# Altium project Bran.PrjPCB
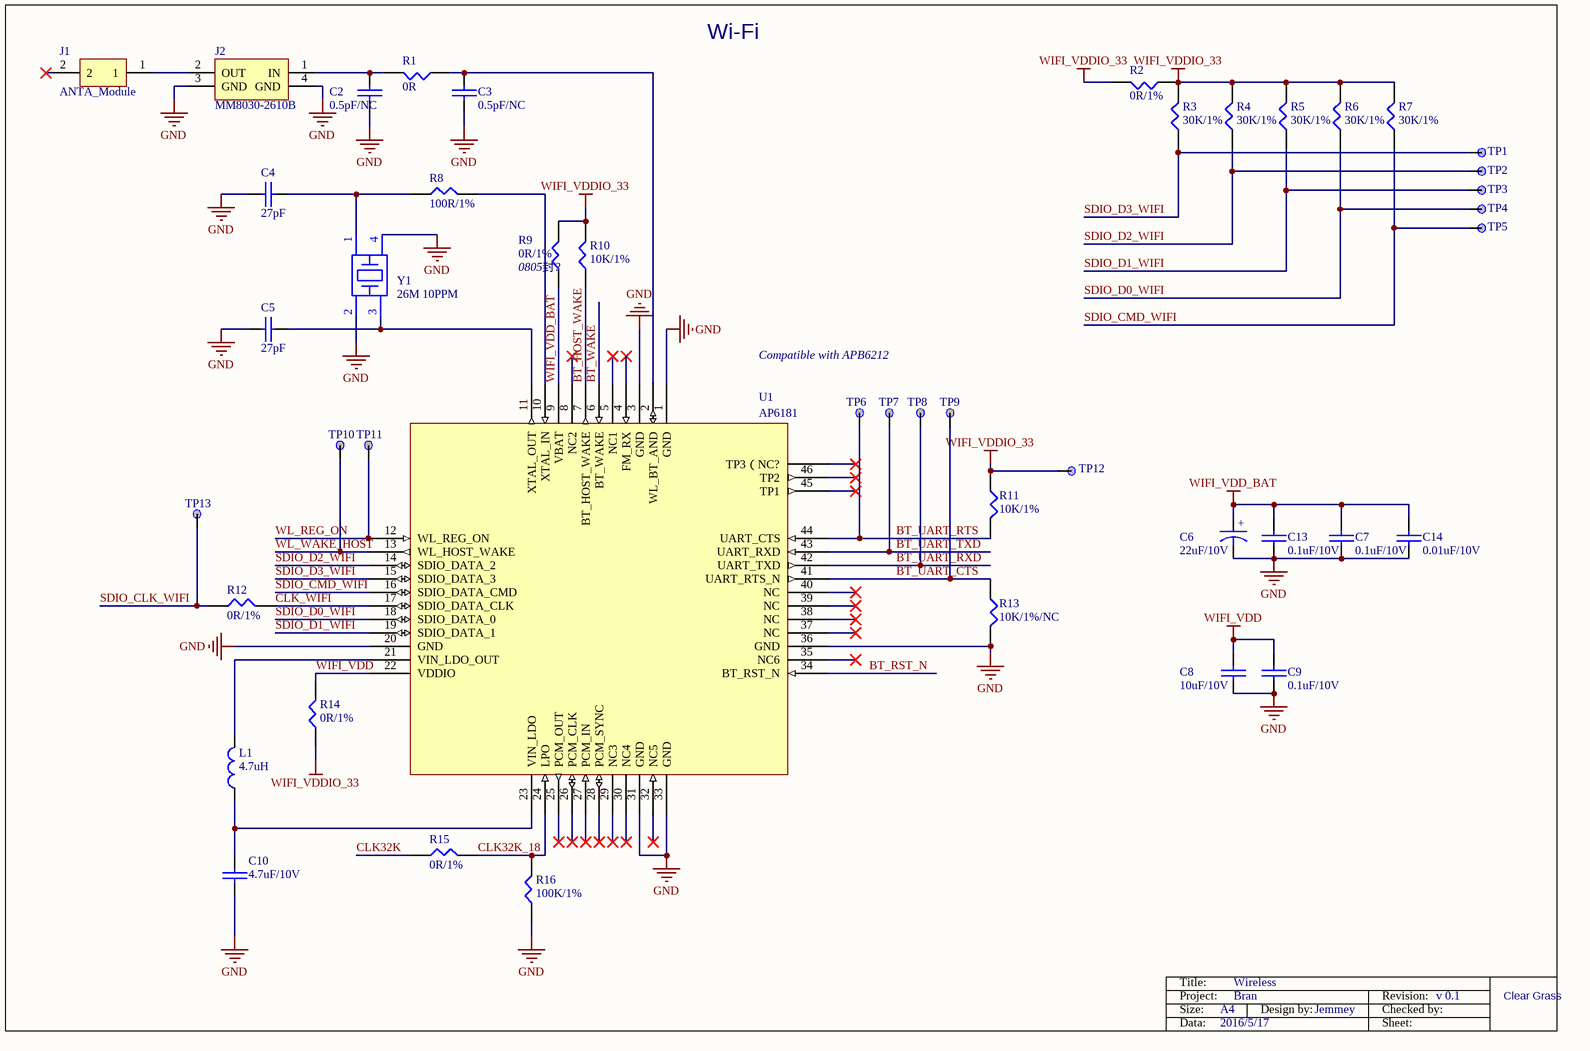
[diagram p0: Wireless.SchDoc]
6 sheets, 197 parts. Net scope: flat (ports and power ports of the same name join across sheets).
Sheets:
  Wireless.SchDoc
  NandFlash.SchDoc
  PMU.SchDoc
  Power.SchDoc
  Peripherals.SchDoc
  Auxiliary.SchDoc

## Sheet Wireless.SchDoc: main_assy PCB
size A4

### Parts
(Parts that share a designator on the sheet are numbered #1, #2 ... from top to bottom, then left to right.)
C2  0.5pF/NC  [0402C]
C3  0.5pF/NC  [0402C]
C4  27pF  [0402C]
C5  27pF  [0402C]
C6  22uF/10V  [6032]
C7  0.1uF/10V  [0402C]
C8  10uF/10V  [0402C]
C9  0.1uF/10V  [0402C]
C10  4.7uF/10V  [0402C]
C13  0.1uF/10V  [0402C]
C14  0.01uF/10V  [0402C]
J1  ANTA_Module  [IPEX]
J2  MM8030-2610B  [IPEX]
L1  4.7uH  [Inductance]
R1  0R  [0402R]
R2  0R/1%  [0402R]
R3  30K/1%  [0402R]
R4  30K/1%  [0402R]
R5  30K/1%  [0402R]
R6  30K/1%  [0402R]
R7  30K/1%  [0402R]
R8  100R/1%  [0402R]
R9  0R/1%  [0402R]
R10#1  10K/1%  [0402R]
R11  10K/1%  [0402R]
R12  0R/1%  [0402R]
R13  10K/1%/NC  [0402R]
R14  0R/1%  [0402R]
R15  0R/1%  [0402R]
R16  100K/1%  [0402R]
TP1  TP  [TP_C40]  (value not drawn)
TP2  TP  [TP_C40]  (value not drawn)
TP3  TP  [TP_C40]  (value not drawn)
TP4  TP  [TP_C40]  (value not drawn)
TP5  TP  [TP_C40]  (value not drawn)
TP6  TP  [TP_C40]  (value not drawn)
TP7  TP  [TP_C40]  (value not drawn)
TP8  TP  [TP_C40]  (value not drawn)
TP9  TP  [TP_C40]  (value not drawn)
TP10  TP  [TP_C40]  (value not drawn)
TP11  TP  [TP_C40]  (value not drawn)
TP12  TP  [TP_C40]  (value not drawn)
TP13  TP  [TP_C40]  (value not drawn)
U1  AP6181
Y1  26M 10PPM  [XTALSMD2-2520]

### Nets
GND: C2.2 C3.2 C4.1 C5.1 C6.2 C7.1 C8.1 C9.1 C10.2 C13.1 C14.1 J2.3(GND) J2.4(GND) R13.2 R16.1 U1.1(GND) U1.3(GND) U1.20(GND) U1.31(GND) U1.33(GND) U1.36(GND) Y1.2 Y1.4
WIFI_VDD: C8.2 C9.2 R14.2 U1.22(VDDIO)
WIFI_VDD_BAT: C6.1 C7.2 C13.2 C14.2 R9.1 U1.9(VBAT)
WIFI_VDDIO_33: R2.1 R2.2 R3.2 R4.2 R5.2 R6.2 R7.2 R9.2 R10#1.2 R11.1 R14.1 TP12.1
BT_HOST_WAKE: R10#1.1 U1.7(BT_HOST_WAKE)
BT_RST_N: U1.34(BT_RST_N)
BT_UART_CTS: R13.1 TP9.1 U1.41(UART_RTS_N)
BT_UART_RTS: R11.2 TP6.1 U1.44(UART_CTS)
BT_UART_RXD: TP8.1 U1.42(UART_TXD)
BT_UART_TXD: TP7.1 U1.43(UART_RXD)
BT_WAKE: U1.6(BT_WAKE)
CLK32K: R15.1
CLK32K_18: R15.2 R16.2 U1.24(LPO)
CLK_WIFI: R12.2 U1.17(SDIO_DATA_CLK)
SDIO_CLK_WIFI: R12.1 TP13.1
SDIO_CMD_WIFI: R7.1 TP5.1 U1.16(SDIO_DATA_CMD)
SDIO_D0_WIFI: R6.1 TP4.1 U1.18(SDIO_DATA_0)
SDIO_D1_WIFI: R5.1 TP3.1 U1.19(SDIO_DATA_1)
SDIO_D2_WIFI: R4.1 TP2.1 U1.14(SDIO_DATA_2)
SDIO_D3_WIFI: R3.1 TP1.1 U1.15(SDIO_DATA_3)
WL_REG_ON: TP11.1 U1.12(WL_REG_ON)
WL_WAKE_HOST: TP10.1 U1.13(WL_HOST_WAKE)
NetC2_1: C2.1 J2.1(IN) R1.2
NetC3_1: C3.1 R1.1 U1.2(WL_BT_AND)
NetC4_2: C4.2 R8.1 Y1.1
NetC5_2: C5.2 U1.11(XTAL_OUT) Y1.3
NetC10_1: C10.1 L1.1 U1.23(VIN_LDO)
NetJ1_1: J1.1 J2.2(OUT)
NetL1_2: L1.2 U1.21(VIN_LDO_OUT)
NetR8_2: R8.2 U1.10(XTAL_IN)

Not connected (* = marked no-connect by the designer): J1 2*; U1 4(FM_RX)* 5(NC1)* 8(NC2)* 25(PCM_OUT)* 26(PCM_CLK)* 27(PCM_IN)* 28(PCM_SYNC)* 29(NC3)* 30(NC4)* 32(NC5)* 35(NC6)* 37(NC)* 38(NC)* 39(NC)* 40(NC)* 45(TP1)* 46(TP2)* ?1(TP3（NC?)*

### Notes on the sheet
- Wi-Fi
- (near R9) 0805封?
- Compatible with APB6212
- Title:
- Wireless
- Project:
- Size:
- Data:
- A4
- 2016/5/17
- Bran
- Design by:
- Jemmey
- Revision:
- Sheet:
- Checked by:
- v 0.1
- Clear Grass
- (in symbol Capacitor) +

### Library data of the parts
C2 = CAP: 厂家：Murata，型号：GRM1555C1H1R0BA01D
C3 = CAP: None
C4 C5 C7-C10 C13 C14 = CAP: 厂家：Murata，型号：GRM155R71A104KA01D
C6 = Capacitor
J2 = SMA: 厂家：Murata，型号：MM8030-2610B
L1 = CHOKE
R1 = RES1: 厂家：Yageo，型号：RC0402FR-070RL
R2-R9 R10#1 R11-R16 = RES1: 厂家：Yageo，型号：RC0402FR-0710KL
TP1-TP13 = TP: Ordered by: Subcon
U1 = AP6181: 厂家：正基，型号：AP6181
Y1 = CRYSTAL2: 厂家：EPSON，型号：Q24FA20H0004400

## Sheet NandFlash.SchDoc: main_assy PCB
size A4
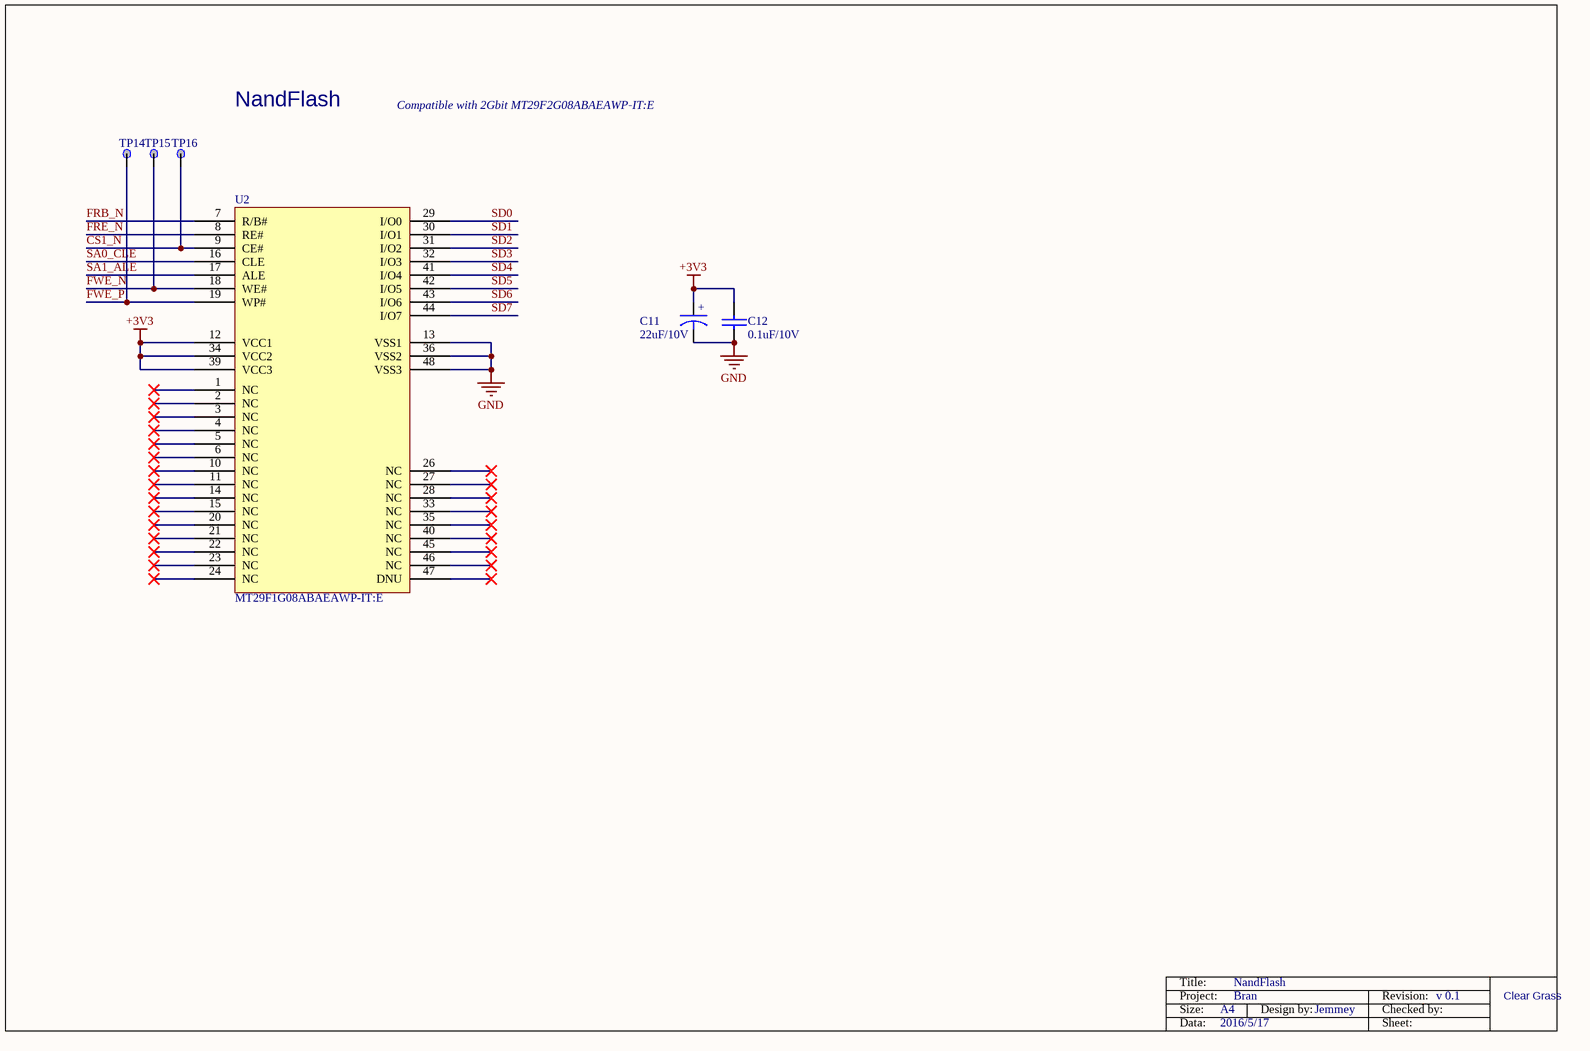
[diagram p1: NandFlash.SchDoc]

### Parts
C11  22uF/10V  [6032]
C12  0.1uF/10V  [0402C]
TP14  TP  [TP_C40]  (value not drawn)
TP15  TP  [TP_C40]  (value not drawn)
TP16  TP  [TP_C40]  (value not drawn)
U2  MT29F1G08ABAEAWP-IT:E

### Nets
+3V3: C11.1 C12.2 U2.12(VCC1) U2.34(VCC2) U2.39(VCC3)
GND: C11.2 C12.1 U2.13(VSS1) U2.36(VSS2) U2.48(VSS3)
CS1_N: TP16.1 U2.9(CE#)
FRB_N: U2.7(R/B#)
FRE_N: U2.8(RE#)
FWE_N: TP15.1 U2.18(WE#)
FWE_P: TP14.1 U2.19(WP#)
SA0_CLE: U2.16(CLE)
SA1_ALE: U2.17(ALE)
SD0: U2.29(I/O0)
SD1: U2.30(I/O1)
SD2: U2.31(I/O2)
SD3: U2.32(I/O3)
SD4: U2.41(I/O4)
SD5: U2.42(I/O5)
SD6: U2.43(I/O6)
SD7: U2.44(I/O7)

Not connected (* = marked no-connect by the designer): U2 1(NC)* 2(NC)* 3(NC)* 4(NC)* 5(NC)* 6(NC)* 10(NC)* 11(NC)* 14(NC)* 15(NC)* 20(NC)* 21(NC)* 22(NC)* 23(NC)* 24(NC)* 26(NC)* 27(NC)* 28(NC)* 33(NC)* 35(NC)* 40(NC)* 45(NC)* 46(NC)* 47(DNU)*

### Notes on the sheet
- NandFlash
- Compatible with 2Gbit MT29F2G08ABAEAWP-IT:E
- Title:
- Project:
- Size:
- Data:
- A4
- 2016/5/17
- Bran
- Design by:
- Jemmey
- Revision:
- Sheet:
- Checked by:
- v 0.1
- Clear Grass
- (in symbol Capacitor) +

### Library data of the parts
C11 = Capacitor
C12 = CAP: 厂家：Murata，型号：GRM155R71A104KA01D
TP14-TP16 = TP: Ordered by: Subcon
U2 = NandFlash

## Sheet PMU.SchDoc: main_assy PCB
size A4
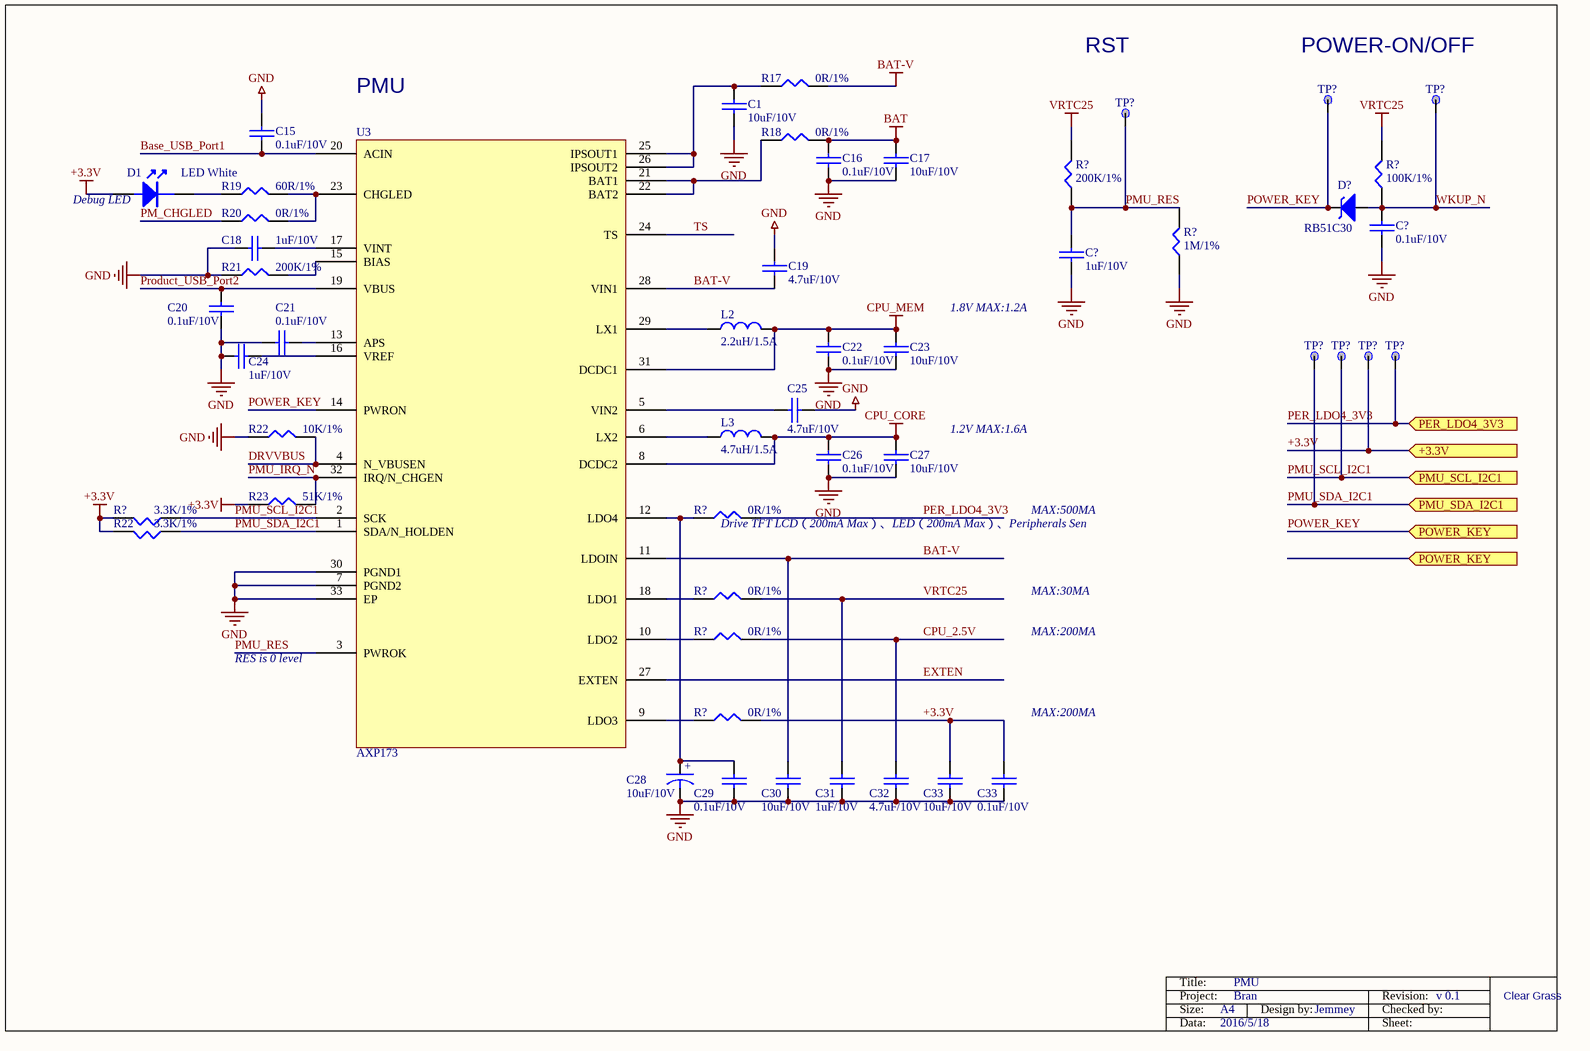
[diagram p2: PMU.SchDoc]

### Parts
(Parts that share a designator on the sheet are numbered #1, #2 ... from top to bottom, then left to right.)
C1  10uF/10V  [0402C]
C15  0.1uF/10V  [0402C]
C16  0.1uF/10V  [0402C]
C17  10uF/10V  [0402C]
C18  1uF/10V  [0402C]
C19  4.7uF/10V  [0402C]
C20  0.1uF/10V  [0402C]
C21  0.1uF/10V  [0402C]
C22  0.1uF/10V  [0402C]
C23  10uF/10V  [0402C]
C24  1uF/10V  [0402C]
C25  4.7uF/10V  [0402C]
C26  0.1uF/10V  [0402C]
C27#1  10uF/10V  [0402C]
C28  10uF/10V  [6032]
C29  0.1uF/10V  [0402C]
C30  10uF/10V  [0402C]
C31  1uF/10V  [0402C]
C32  4.7uF/10V  [0402C]
C33#1  10uF/10V  [0402C]
C33#2  0.1uF/10V  [0402C]
C?#1  0.1uF/10V  [0402C]
C?#2  1uF/10V  [0402C]
D1  LED White  [0402LED]
D?  RB51C30  [DO-214AC]
L2  2.2uH/1.5A  [Inductance]
L3#1  4.7uH/1.5A  [Inductance]
R17  0R/1%  [0402R]
R18  0R/1%  [0402R]
R19  60R/1%  [0402R]
R20  0R/1%  [0402R]
R21  200K/1%  [0402R]
R22#1  10K/1%  [0402R]
R22#2  3.3K/1%  [0402R]
R23  51K/1%  [0402R]
R?#1  200K/1%  [0402R]
R?#2  100K/1%  [0402R]
R?#3  1M/1%  [0402R]
R?#4  0R/1%  [0402R]
R?#5  3.3K/1%  [0402R]
R?#6  0R/1%  [0402R]
R?#7  0R/1%  [0402R]
R?#8  0R/1%  [0402R]
TP?#1  TP  [TP_C40]  (value not drawn)
TP?#2  TP  [TP_C40]  (value not drawn)
TP?#3  TP  [TP_C40]  (value not drawn)
TP?#4  TP  [TP_C40]  (value not drawn)
TP?#5  TP  [TP_C40]  (value not drawn)
TP?#6  TP  [TP_C40]  (value not drawn)
TP?#7  TP  [TP_C40]  (value not drawn)
U3  AXP173

### Ports
+3.3V (in), PER_LDO4_3V3 (in), PMU_SCL_I2C1 (in), PMU_SDA_I2C1 (in), POWER_KEY (in)

### Nets
+3.3V: C33#1.1 C33#2.1 D1.2 R22#2.2 R23.1 R?#5.2 R?#8.2 TP?#6.1 ; port +3.3V
BAT: C16.2 C17.2 R18.2
BAT-V: C19.2 C30.1 R17.2 U3.11(LDOIN) U3.28(VIN1)
CPU_CORE: C26.2 C27#1.2 L3#1.2 U3.8(DCDC2)
CPU_MEM: C22.2 C23.2 L2.2 U3.31(DCDC1)
GND: C1.1 C15.2 C16.1 C17.1 C18.2 C19.1 C20.1 C21.2 C22.1 C23.1 C24.2 C25.1 C26.1 C27#1.1 C28.2 C29.1 C30.2 C31.2 C32.2 C33#1.2 C33#2.2 C?#1.1 C?#2.1 R21.1 R22#1.1 R?#3.1 U3.7(PGND2) U3.30(PGND1) U3.33(EP)
PER_LDO4_3V3: R?#4.2 TP?#7.1 ; port PER_LDO4_3V3
VRTC25: C31.1 R?#1.2 R?#2.2 R?#6.2
Base_USB_Port1: C15.1 U3.20(ACIN)
CPU_2.5V: C32.1 R?#7.2
DRVVBUS: R22#1.2 U3.4(N_VBUSEN)
EXTEN: U3.27(EXTEN)
PM_CHGLED: R20.1
PMU_IRQ_N: R23.2 U3.32(IRQ/N_CHGEN)
PMU_RES: C?#2.2 R?#1.1 R?#3.2 TP?#3.1 U3.3(PWROK)
PMU_SCL_I2C1: R?#5.1 TP?#5.1 U3.2(SCK) ; port PMU_SCL_I2C1
PMU_SDA_I2C1: R22#2.1 TP?#4.1 U3.1(SDA/N_HOLDEN) ; port PMU_SDA_I2C1
POWER_KEY: D?.1(K) TP?#1.1 U3.14(PWRON) ; port POWER_KEY
Product_USB_Port2: C20.2 U3.19(VBUS)
TS: U3.24(TS)
WKUP_N: C?#1.2 D?.2(A) R?#2.1 TP?#2.1
NetC1_2: C1.2 R17.1 U3.25(IPSOUT1) U3.26(IPSOUT2)
NetC18_1: C18.1 U3.17(VINT)
NetC21_1: C21.1 U3.13(APS)
NetC24_1: C24.1 U3.16(VREF)
NetC25_2: C25.2 U3.5(VIN2)
NetC28_1: C28.1 C29.2 R?#4.1 U3.12(LDO4)
NetD1_1: D1.1 R19.1
NetL2_1: L2.1 U3.29(LX1)
NetL3#1_1: L3#1.1 U3.6(LX2)
NetR18_1: R18.1 U3.21(BAT1) U3.22(BAT2)
NetR19_2: R19.2 R20.2 U3.23(CHGLED)
NetR21_2: R21.2 U3.15(BIAS)
NetR?#6_1: R?#6.1 U3.18(LDO1)
NetR?#7_1: R?#7.1 U3.10(LDO2)
NetR?#8_1: R?#8.1 U3.9(LDO3)

### Notes on the sheet
- PMU
- RST
- (near TP?#1) POWER-ON/OFF
- (near D1) Debug LED
- 1.8V MAX:1.2A
- 1.2V MAX:1.6A
- MAX:500MA
- (near R?#4) Drive TFT LCD（200mA Max）、LED（200mA Max）、Peripherals Sen
- MAX:30MA
- MAX:200MA
- (near U3) RES is 0 level
- Title:
- Project:
- Size:
- Data:
- A4
- 2016/5/18
- Bran
- Design by:
- Jemmey
- Revision:
- Sheet:
- Checked by:
- v 0.1
- Clear Grass
- (in symbol Capacitor) +

### Library data of the parts
C1 C15-C26 C27#1 C29-C32 C33#1 C33#2 C?#1 C?#2 = CAP: 厂家：Murata，型号：GRM155R71A104KA01D
C28 = Capacitor
D1 = LED: 厂家：ROHM，型号：SCMP13WBC8W1**
D? = Schottky barri: 厂家：ROHM，型号：RB480Y-90
L2 L3#1 = CHOKE
R17-R21 R22#1 R22#2 R23 R?#1-R?#8 = RES1: 厂家：Yageo，型号：RC0402FR-0710KL
TP?#1-TP?#7 = TP: Ordered by: Subcon

## Sheet Power.SchDoc: main_assy PCB
size A4
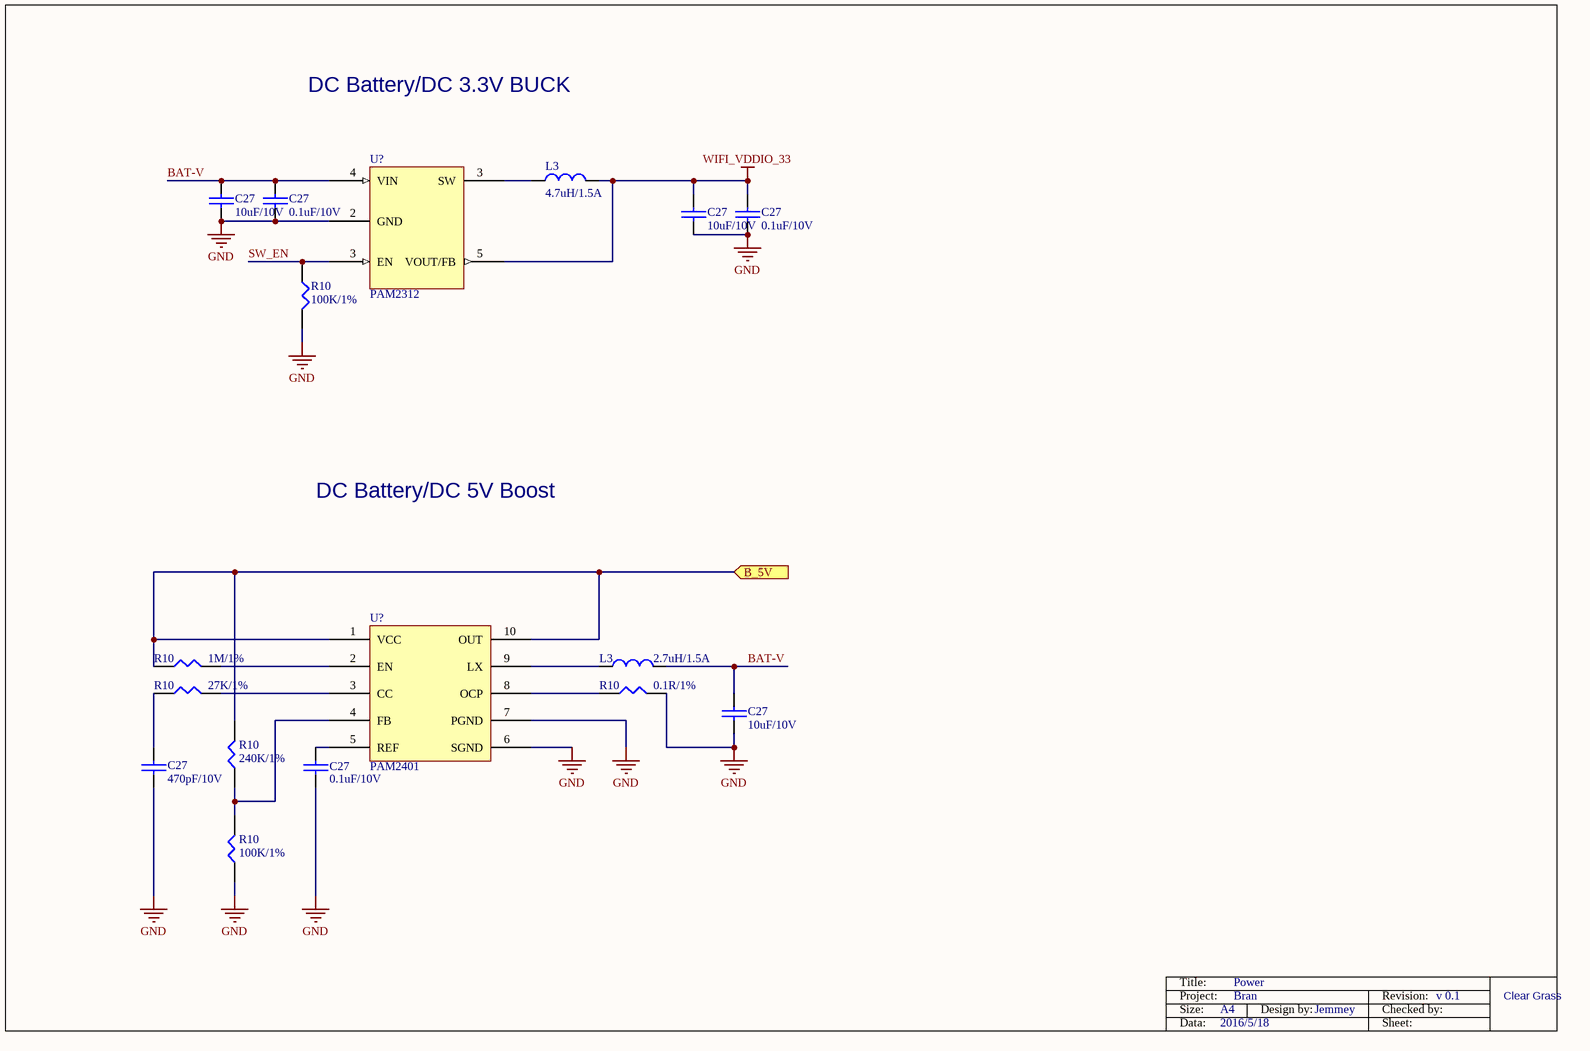
[diagram p3: Power.SchDoc]

### Parts
(Parts that share a designator on the sheet are numbered #1, #2 ... from top to bottom, then left to right.)
C27#2  10uF/10V  [0402C]
C27#3  0.1uF/10V  [0402C]
C27#4  10uF/10V  [0402C]
C27#5  0.1uF/10V  [0402C]
C27#6  10uF/10V  [0402C]
C27#7  470pF/10V  [0402C]
C27#8  0.1uF/10V  [0402C]
L3#2  4.7uH/1.5A  [Inductance]
L3#3  2.7uH/1.5A  [Inductance]
R10#2  100K/1%  [0402R]
R10#3  1M/1%  [0402R]
R10#4  27K/1%  [0402R]
R10#5  0.1R/1%  [0402R]
R10#6  240K/1%  [0402R]
R10#7  100K/1%  [0402R]
U?#1  PAM2312  [MOLEX_47590001]
U?#2  PAM2401  [MOLEX_47590001]

### Ports
B_5V (in)

### Nets
GND: C27#2.1 C27#3.1 C27#4.1 C27#5.1 C27#6.1 C27#7.1 C27#8.1 R10#2.2 R10#5.2 R10#7.1 U?#1.2(GND) U?#2.6(SGND) U?#2.7(PGND)
WIFI_VDDIO_33: C27#4.2 C27#5.2 L3#2.2 U?#1.5(VOUT/FB)
BAT-V: C27#2.2 C27#3.2 C27#6.2 L3#3.2 U?#1.4(VIN)
SW_EN: R10#2.1 U?#1.3(EN)
NetC27#7_2: C27#7.2 R10#4.1
NetC27#8_2: C27#8.2 U?#2.5(REF)
NetL3#2_1: L3#2.1 U?#1.3(SW)
NetL3#3_1: L3#3.1 U?#2.9(LX)
NetR10#3_1: R10#3.1 R10#6.2 U?#2.1(VCC) U?#2.10(OUT) ; port B_5V
NetR10#3_2: R10#3.2 U?#2.2(EN)
NetR10#4_2: R10#4.2 U?#2.3(CC)
NetR10#5_1: R10#5.1 U?#2.8(OCP)
NetR10#6_1: R10#6.1 R10#7.2 U?#2.4(FB)

### Notes on the sheet
- DC Battery/DC 3.3V BUCK
- DC Battery/DC 5V Boost
- Title:
- Power
- Project:
- Size:
- Data:
- A4
- 2016/5/18
- Bran
- Design by:
- Jemmey
- Revision:
- Sheet:
- Checked by:
- v 0.1
- Clear Grass

### Library data of the parts
C27#2-C27#8 = CAP: 厂家：Murata，型号：GRM155R71A104KA01D
L3#2 L3#3 = CHOKE
R10#2-R10#7 = RES1: 厂家：Yageo，型号：RC0402FR-0710KL
U?#1 = P: 厂家：Diodes，型号：PAM2312TSOT255330; Manuf_1: MOLEX; Manuf_Part_1: 475900001; Ordered by: Subcon; Silkscreen: USB USER
U?#2 = PAM: 厂家：Diodes，型号：PAM2401YPADJ; Manuf_1: MOLEX; Manuf_Part_1: 475900001; Ordered by: Subcon; Silkscreen: USB USER

## Sheet Peripherals.SchDoc: main_assy PCB
size A4
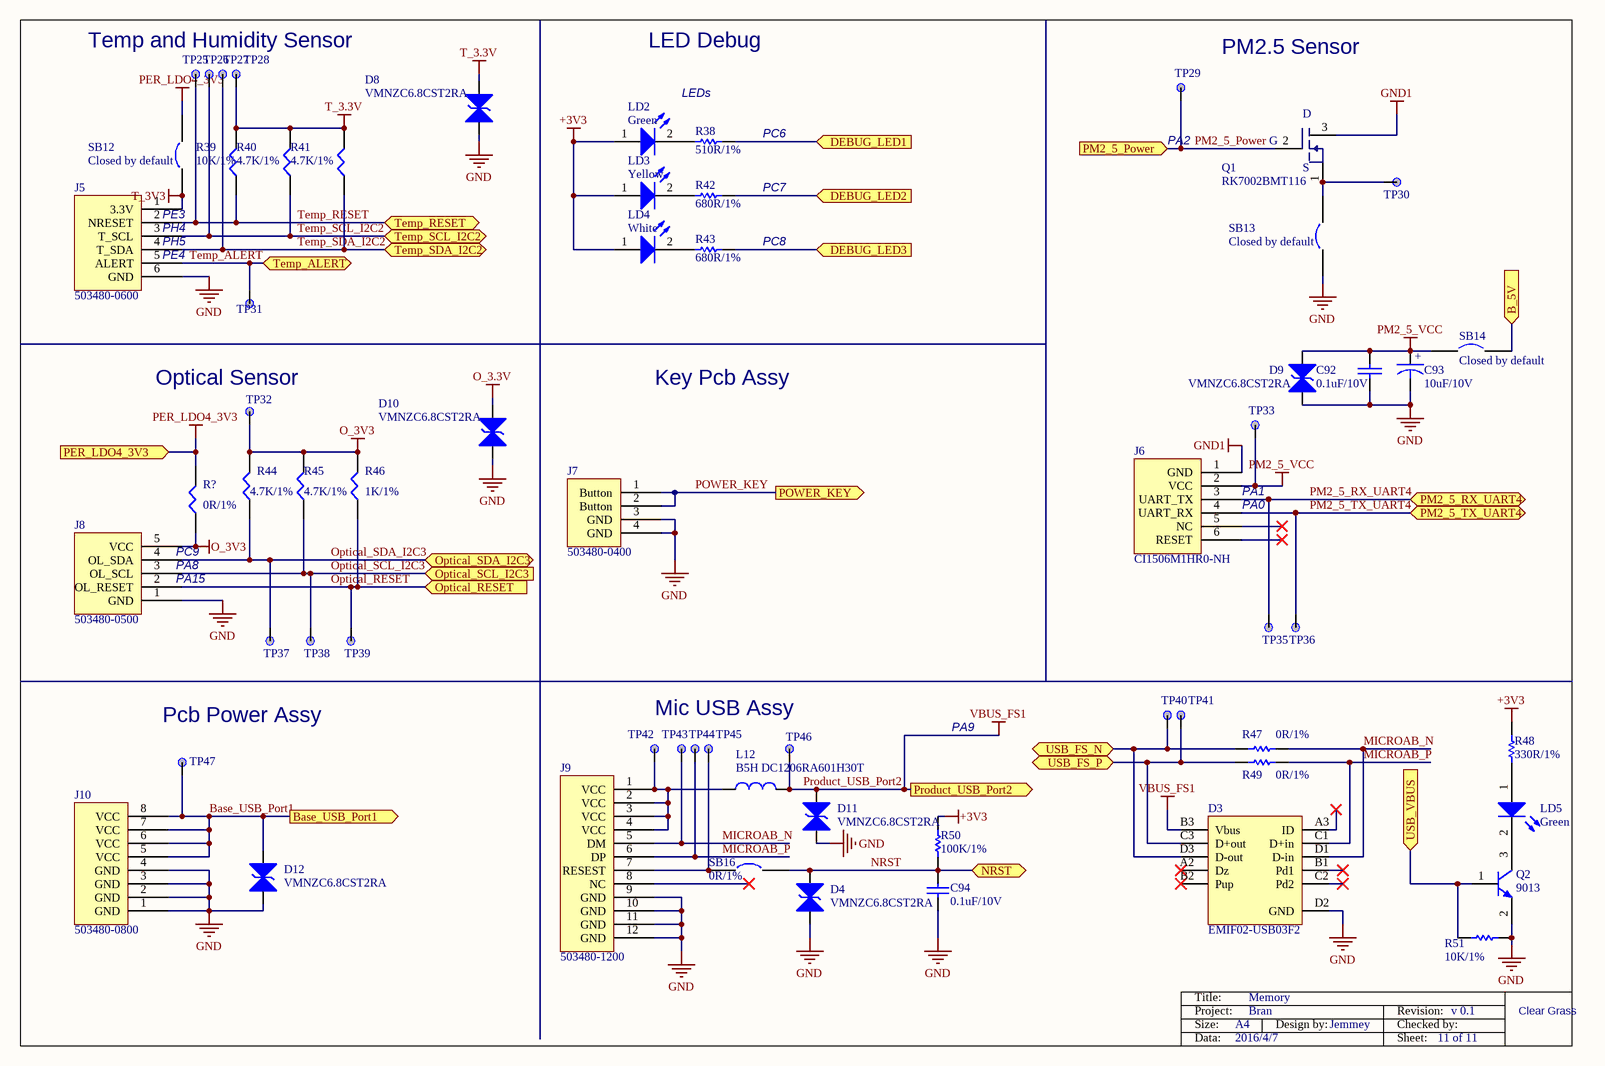
[diagram p4: Peripherals.SchDoc]

### Parts
(Parts that share a designator on the sheet are numbered #1, #2 ... from top to bottom, then left to right.)
C92  0.1uF/10V  [0402C]
C93  10uF/10V  [6032]
C94  0.1uF/10V  [0402C]
D3  EMIF02-USB03F2  [BGA11_0R5_1R57X2R07]
D4  VMNZC6.8CST2RA  [0402]
D8  VMNZC6.8CST2RA  [0402]
D9  VMNZC6.8CST2RA  [0402]
D10  VMNZC6.8CST2RA  [0402]
D11  VMNZC6.8CST2RA  [0402]
D12  VMNZC6.8CST2RA  [0402]
J5  503480-0600
J6  CI1506M1HR0-NH
J7  503480-0400
J8  503480-0500
J9  503480-1200
J10  503480-0800
L12  B5H DC1206RA601H30T  [1206]
LD2  Green  [0603D]
LD3  Yellow  [0603D]
LD4  White  [0603D]
LD5  Green  [0603D]
Q1  RK7002BMT116  [SOT23]
Q2  9013  [SOT-23]
R38  510R/1%  [0402R]
R39  10K/1%  [0402R]
R40  4.7K/1%  [0402R]
R41  4.7K/1%  [0402R]
R42  680R/1%  [0402R]
R43  680R/1%  [0402R]
R44  4.7K/1%  [0402R]
R45  4.7K/1%  [0402R]
R46  1K/1%  [0402R]
R47  0R/1%  [0603R]
R48  330R/1%  [0402R]
R49  0R/1%  [0603R]
R50  100K/1%  [0402R]
R51  10K/1%  [0402R]
R?#9  0R/1%  [0402R]
SB12  Closed by default  [0603R]
SB13  Closed by default  [0603R]
SB14  Closed by default  [0603R]
SB16  0R/1%  [0603R]
TP25  TP  [TP_C40]  (value not drawn)
TP26  TP  [TP_C40]  (value not drawn)
TP27  TP  [TP_C40]  (value not drawn)
TP28  TP  [TP_C40]  (value not drawn)
TP29  TP  [TP_C40]  (value not drawn)
TP30  TP  [TP_C40]  (value not drawn)
TP31  TP  [TP_C40]  (value not drawn)
TP32  TP  [TP_C40]  (value not drawn)
TP33  TP  [TP_C40]  (value not drawn)
TP35  TP  [TP_C40]  (value not drawn)
TP36  TP  [TP_C40]  (value not drawn)
TP37  TP  [TP_C40]  (value not drawn)
TP38  TP  [TP_C40]  (value not drawn)
TP39  TP  [TP_C40]  (value not drawn)
TP40  TP  [TP_C40]  (value not drawn)
TP41  TP  [TP_C40]  (value not drawn)
TP42  TP  [TP_C40]  (value not drawn)
TP43  TP  [TP_C40]  (value not drawn)
TP44  TP  [TP_C40]  (value not drawn)
TP45  TP  [TP_C40]  (value not drawn)
TP46  TP  [TP_C40]  (value not drawn)
TP47  TP  [TP_C40]  (value not drawn)

### Ports
B_5V (in), Base_USB_Port1 (out), DEBUG_LED1 (in), DEBUG_LED2 (in), DEBUG_LED3 (in), NRST (bidir), Optical_RESET (in), Optical_SCL_I2C3 (in), Optical_SDA_I2C3 (bidir), PER_LDO4_3V3 (in), PM2_5_Power (in), PM2_5_RX_UART4 (bidir), PM2_5_TX_UART4 (bidir), POWER_KEY (out), Product_USB_Port2 (out), Temp_ALERT (bidir), Temp_RESET (bidir), Temp_SCL_I2C2 (bidir), Temp_SDA_I2C2 (bidir), USB_FS_N (bidir), USB_FS_P (bidir), USB_VBUS (in)

### Nets
+3V3: LD2.1(A) LD3.1(A) LD4.1(A) R48.2 R50.1
GND: C92.1 C93.2 C94.1 D3.D2(GND) D4.1(Diode1) D8.1(Diode1) D9.1(Diode1) D10.1(Diode1) D11.1(Diode1) D12.1(Diode1) J5.6(GND) J7.3(GND) J7.4(GND) J8.1(GND) J9.9(GND) J9.10(GND) J9.11(GND) J9.12(GND) J10.1(GND) J10.2(GND) J10.3(GND) J10.4(GND) Q2.2(E) R51.1 SB13.1
GND1: J6.1(GND) Q1.3(D)
O_3.3V: D10.2(dIode2)
O_3V3: J8.5(VCC) R44.2 R45.2 R46.2 R?#9.1 TP32.1
PER_LDO4_3V3: R?#9.2 SB12.2 ; port PER_LDO4_3V3
PM2_5_VCC: C92.2 C93.1 D9.2(dIode2) J6.2(VCC) SB14.1 TP33.1
Product_USB_Port2: D3.B3(Vbus) D11.2(dIode2) L12.2 TP46.1 ; port Product_USB_Port2  [also labelled VBUS_FS1]
T_3.3V: D8.2(dIode2) R39.2 R40.2 R41.2 TP28.1
T_3V3: J5.1(3.3V) SB12.1
Base_USB_Port1: D12.2(dIode2) J10.5(VCC) J10.6(VCC) J10.7(VCC) J10.8(VCC) TP47.1 ; port Base_USB_Port1
MICROAB_N: D3.C1(D+in) D3.D1(D-in) J9.5(DM) J9.6(DP) R47.2 R49.2 TP43.1 TP44.1  [also labelled MICROAB_P]
NRST: C94.2 D4.2(dIode2) R50.2 SB16.2 ; port NRST
Optical_RESET: J8.2(OL_RESET) R46.1 TP39.1 ; port Optical_RESET
Optical_SCL_I2C3: J8.3(OL_SCL) R45.1 TP38.1 ; port Optical_SCL_I2C3
Optical_SDA_I2C3: J8.4(OL_SDA) R44.1 TP37.1 ; port Optical_SDA_I2C3
PM2_5_Power: Q1.2(G) TP29.1 ; port PM2_5_Power
PM2_5_RX_UART4: J6.3(UART_TX) TP35.1 ; port PM2_5_RX_UART4
PM2_5_TX_UART4: J6.4(UART_RX) TP36.1 ; port PM2_5_TX_UART4
POWER_KEY: J7.1(Button) J7.2(Button) ; port POWER_KEY
Temp_ALERT: J5.5(ALERT) TP31.1 ; port Temp_ALERT
Temp_RESET: J5.2(NRESET) R39.1 TP25.1 ; port Temp_RESET
Temp_SCL_I2C2: J5.3(T_SCL) R40.1 TP26.1 ; port Temp_SCL_I2C2
Temp_SDA_I2C2: J5.4(T_SDA) R41.1 TP27.1 ; port Temp_SDA_I2C2
NetD3_C3: D3.C3(D+out) R49.1 TP41.1 ; port USB_FS_P
NetD3_D3: D3.D3(D-out) R47.1 TP40.1 ; port USB_FS_N
NetJ9_1: J9.1(VCC) J9.2(VCC) J9.3(VCC) J9.4(VCC) L12.1 TP42.1
NetJ9_7: J9.7(RESEST) SB16.1 TP45.1
NetLD2_2: LD2.2(K) R38.2
NetLD3_2: LD3.2(K) R42.2
NetLD4_2: LD4.2(K) R43.2
NetLD5_1: LD5.1(A) R48.1
NetLD5_2: LD5.2(K) Q2.3(C)
NetQ1_1: Q1.1(S) SB13.2 TP30.1
NetQ2_1: Q2.1(B) R51.2 ; port USB_VBUS
NetR10#3_1: SB14.2 ; port B_5V
NetR38_1: R38.1 ; port DEBUG_LED1
NetR42_1: R42.1 ; port DEBUG_LED2
NetR43_1: R43.1 ; port DEBUG_LED3

Not connected (* = marked no-connect by the designer): D3 A2(Dz)* A3(ID)* B1(Pd1)* B2(Pup)* C2(Pd2)*; J6 5(NC)* 6(RESET)*; J9 8(NC)*

### Notes on the sheet
- Temp and Humidity Sensor
- LED Debug
- PM2.5 Sensor
- LEDs
- (near R38) PC6
- PC7
- (near TP29) PA2
- (near J5) PE4
- (near J5) PE3
- (near J5) PH4
- (near J5) PH5
- PC8
- (near TP32) Optical Sensor
- Key Pcb Assy
- (near J6) PA0
- PA1
- PC9
- PA8
- (near J8) PA15
- (near TP47) Pcb Power Assy
- Mic USB Assy
- PA9
- Title:
- Memory
- Project:
- Size:
- Data:
- A4
- 2016/4/7
- Bran
- Design by:
- Jemmey
- Revision:
- Sheet:
- Checked by:
- 11 of 11
- v 0.1
- Clear Grass
- (in symbol Capacitor) +

### Library data of the parts
C92 = CAP: 厂家：Murata，型号：GRM155R71A104KA01D
C93 = Capacitor
C94 = CAP: Capacitor; Value: 100pF; Ordered by: Subcon; Published: 8-Jun-2000; Revision: July-2002: Re-released for DXP Platform.; Publisher: Altium Limited
D3 = EMIF02-USB03F2: 2-line IPAD, EMI filter including ESD protection; Manuf_1: ST; ECCN_US/EU: EAR99/NEC; Ref St: 9179037; Order: EMIF02-USB03F2; Manuf_Part_1: EMIF02-USB03F2; Provided: ST; Distrib: ST; Ordered by: ST
D4 D8-D12 = ESD_1: 厂家：ROHM，型号：VMNZC6.8CST2RA
J5 = 503480-0600: 厂家：Molex，型号：503480-0600
J6 = CI15: 厂家：瀚荃股份，型号：CI1506M1HR0-NH
J7 = 503480-0400: 厂家：Molex，型号：503480-0400
J8 = 503480-0500: 厂家：Molex，型号：503480-0500
J9 = 503480-1200: 厂家：Molex，型号：503480-1200
J10 = 503480-0800: 厂家：Molex，型号：503480-0800
L12 = CHOKE: 厂家：宇磁，型号：B5H DC1206RA601H30T
LD2-LD4 = LED2: Typical RED, GREEN, YELLOW, AMBER GaAs LED; Ordered by: Subcon; ECCN_US/EU: EAR99/NEC; Published: 8-Jun-2000; Revision: July-2002: Re-released for DXP Platform.; Publisher: Altium Limited
LD5 = LED2: Typical RED, GREEN, YELLOW, AMBER GaAs LED; Ordered by: Subcon; ECCN_US/EU: EAR99/NEC; Silkscreen: VBUS; Published: 8-Jun-2000; Revision: July-2002: Re-released for DXP Platform.; Publisher: Altium Limited
Q1 = RK7002: 厂家：ROHM，型号：RK7002BMT116
Q2 = NPN: NPN Bipolar Transistor; Manuf_Part_1: MMBT9013; Code - JEDEC: TO-226-AA; Ordered by: Subcon; ECCN_US/EU: EAR99/NEC; Published: 8-Jun-2000; Revision: July-2002: Re-released for DXP Platform.; Publisher: Altium Limited
R38 R42 R43 R47 R49 = Res1: Resistor; Value: 1K; Ordered by: Subcon; Published: 8-Jun-2000; Revision: July-2002: Re-released for DXP Platform.; Publisher: Altium Limited
R39 R40 R44 R45 R?#9 = RES1: 厂家：Yageo，型号：
R41 R46 = RES1: 厂家：Yageo，型号：RC0402FR-0710KL
R48 = res1: Resistor; Value: 1K; Ordered by: Subcon; Published: 8-Jun-2000; Revision: July-2002: Re-released for DXP Platform.; Publisher: Altium Limited
R50 = res1: 厂家：Yageo，型号：RC0402FR-07100KL; Value: 1K; Ordered by: Subcon; Published: 8-Jun-2000; Revision: July-2002: Re-released for DXP Platform.; Publisher: Altium Limited
R51 = res1: 厂家：Yageo，型号：RC0402FR-0710KL; Value: 1K; Ordered by: Subcon; Published: 8-Jun-2000; Revision: July-2002: Re-released for DXP Platform.; Publisher: Altium Limited
SB12-SB14 = Circuit Breaker: Ordered by: Subcon; Comments: Solder bridge; Fitted: NO; Published: 24-Mar-1999; Revision: July-2002: Re-released for DXP Platform.; Publisher: Altium Limited
SB16 = Circuit Breaker: Ordered by: Subcon; Comments: Solder bridge; Published: 24-Mar-1999; Revision: July-2002: Re-released for DXP Platform.; Publisher: Altium Limited
TP25-TP33 TP35-TP47 = TP: Ordered by: Subcon

## Sheet Auxiliary.SchDoc: main_assy PCB
size A4
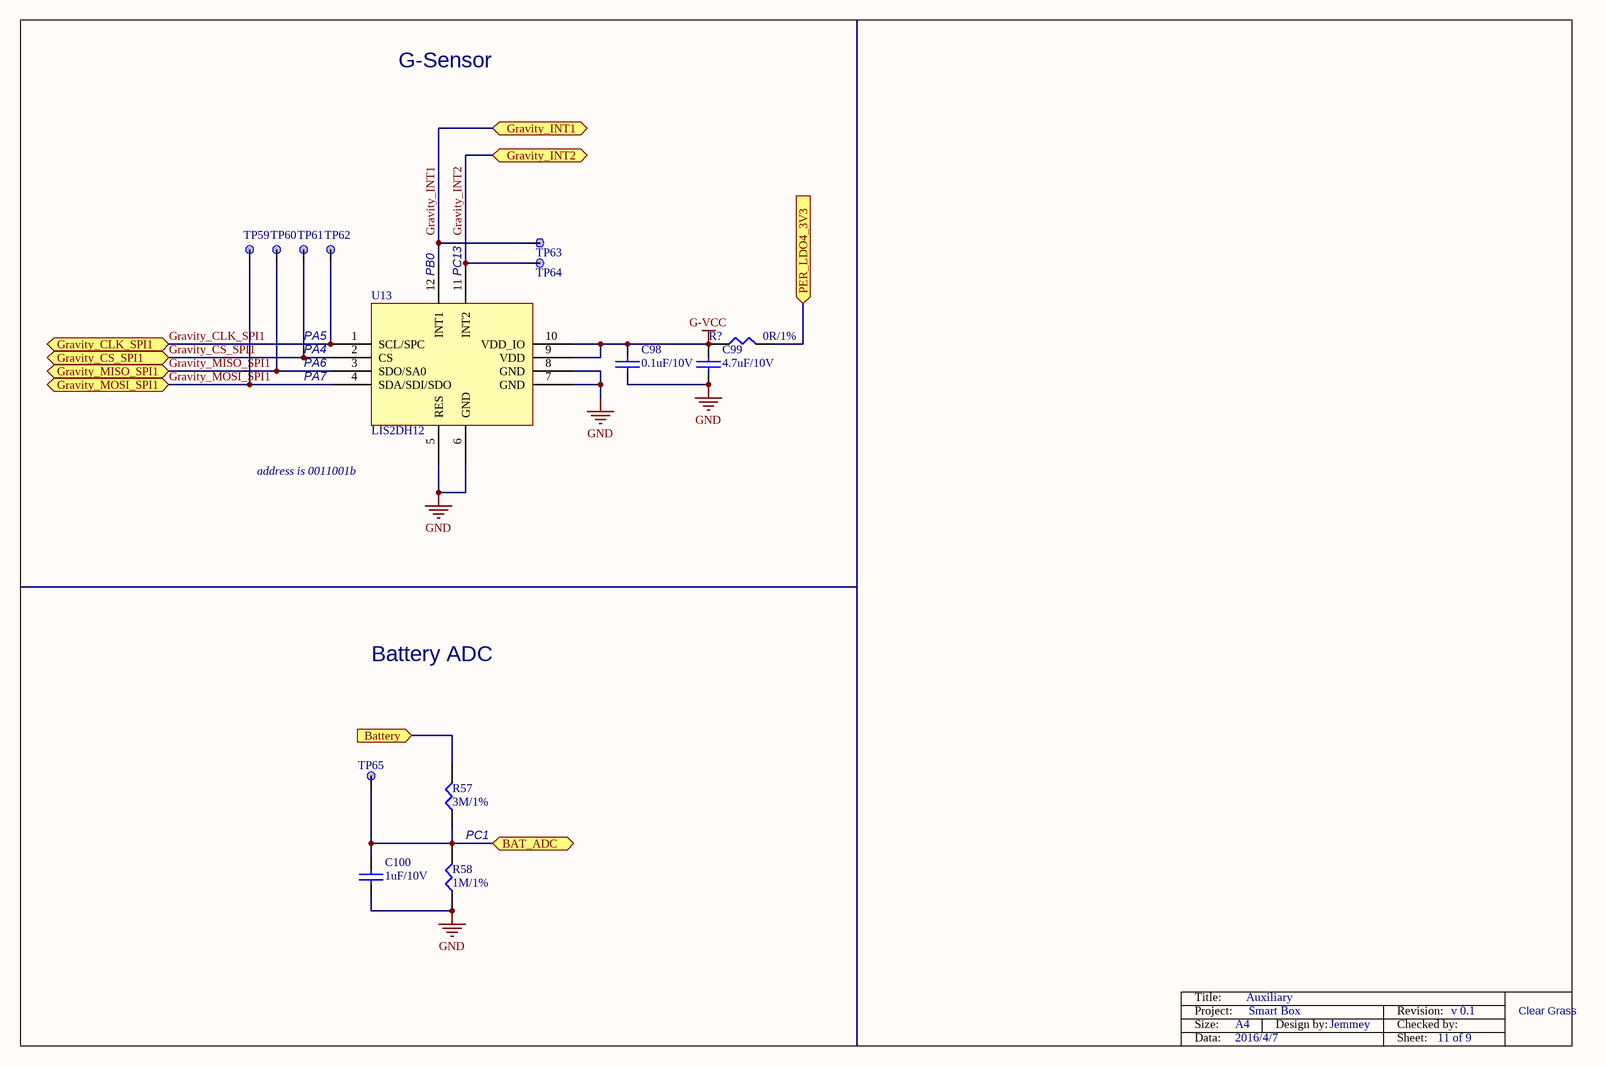
[diagram p5: Auxiliary.SchDoc]

### Parts
(Parts that share a designator on the sheet are numbered #1, #2 ... from top to bottom, then left to right.)
C98  0.1uF/10V  [0402C]
C99  4.7uF/10V  [0603C]
C100  1uF/10V  [0402C]
R57  3M/1%  [0402R]
R58  1M/1%  [0402R]
R?#10  0R/1%  [0402R]
TP59  TP  [TP_C40]  (value not drawn)
TP60  TP  [TP_C40]  (value not drawn)
TP61  TP  [TP_C40]  (value not drawn)
TP62  TP  [TP_C40]  (value not drawn)
TP63  TP  [TP_C40]  (value not drawn)
TP64  TP  [TP_C40]  (value not drawn)
TP65  TP  [TP_C40]  (value not drawn)
U13  LIS2DH12

### Ports
BAT_ADC, Battery (in), Gravity_CLK_SPI1 (bidir), Gravity_CS_SPI1 (bidir), Gravity_INT1 (bidir), Gravity_INT2 (bidir), Gravity_MISO_SPI1 (bidir), Gravity_MOSI_SPI1 (bidir), PER_LDO4_3V3 (in)

### Nets
G-VCC: C98.1 C99.1 R?#10.1 U13.9(VDD) U13.10(VDD_IO)
GND: C98.2 C99.2 C100.2 R58.1 U13.5(RES) U13.6(GND) U13.7(GND) U13.8(GND)
PER_LDO4_3V3: R?#10.2 ; port PER_LDO4_3V3
Gravity_CLK_SPI1: TP62.1 U13.1(SCL/SPC) ; port Gravity_CLK_SPI1
Gravity_CS_SPI1: TP61.1 U13.2(CS) ; port Gravity_CS_SPI1
Gravity_INT1: TP63.1 U13.12(INT1) ; port Gravity_INT1
Gravity_INT2: TP64.1 U13.11(INT2) ; port Gravity_INT2
Gravity_MISO_SPI1: TP60.1 U13.3(SDO/SA0) ; port Gravity_MISO_SPI1
Gravity_MOSI_SPI1: TP59.1 U13.4(SDA/SDI/SDO) ; port Gravity_MOSI_SPI1
NetC100_1: C100.1 R57.1 R58.2 TP65.1 ; port BAT_ADC
NetR57_2: R57.2 ; port Battery

### Notes on the sheet
- G-Sensor
- (near U13) PB0
- (near U13) PC13
- (near U13) PA7
- (near U13) PA6
- (near U13) PA4
- (near U13) PA5
- (near U13) address is 0011001b
- Battery ADC
- PC1
- Title:
- Auxiliary
- Project:
- Size:
- Data:
- A4
- 2016/4/7
- Smart Box
- Design by:
- Jemmey
- Revision:
- Sheet:
- Checked by:
- 11 of 9
- v 0.1
- Clear Grass

### Library data of the parts
C98 C100 = CAP: 厂家：Murata，型号：GRM155R71A104KA01D
C99 = CAP: 厂家：Murata，型号：GRM188R61A106KE69D
R57 R58 R?#10 = RES1: 厂家：Yageo，型号：RC0402FR-0710KL
TP59-TP65 = TP: Ordered by: Subcon
U13 = LI: 厂家：ST，型号：LIS2DH12

## Nets that join several sheets
+3V3: NandFlash (5 pins), Peripherals (5 pins)
GND: Wireless (23 pins), NandFlash (5 pins), PMU (29 pins), Power (13 pins), Peripherals (25 pins), Auxiliary (8 pins)
PER_LDO4_3V3: PMU (R?#4.2 TP?#7.1), Peripherals (R?#9.2 SB12.2), Auxiliary (R?#10.2)
WIFI_VDDIO_33: Wireless (12 pins), Power (C27#4.2 C27#5.2 L3#2.2 U?#1.5)
NetR10#3_1: Power (R10#3.1 R10#6.2 U?#2.1 U?#2.10), Peripherals (SB14.2)
POWER_KEY: PMU (D?.1 TP?#1.1 U3.14), Peripherals (J7.1 J7.2)